# Altium project DIOT_Template.PrjPCB (part 1 of 3)
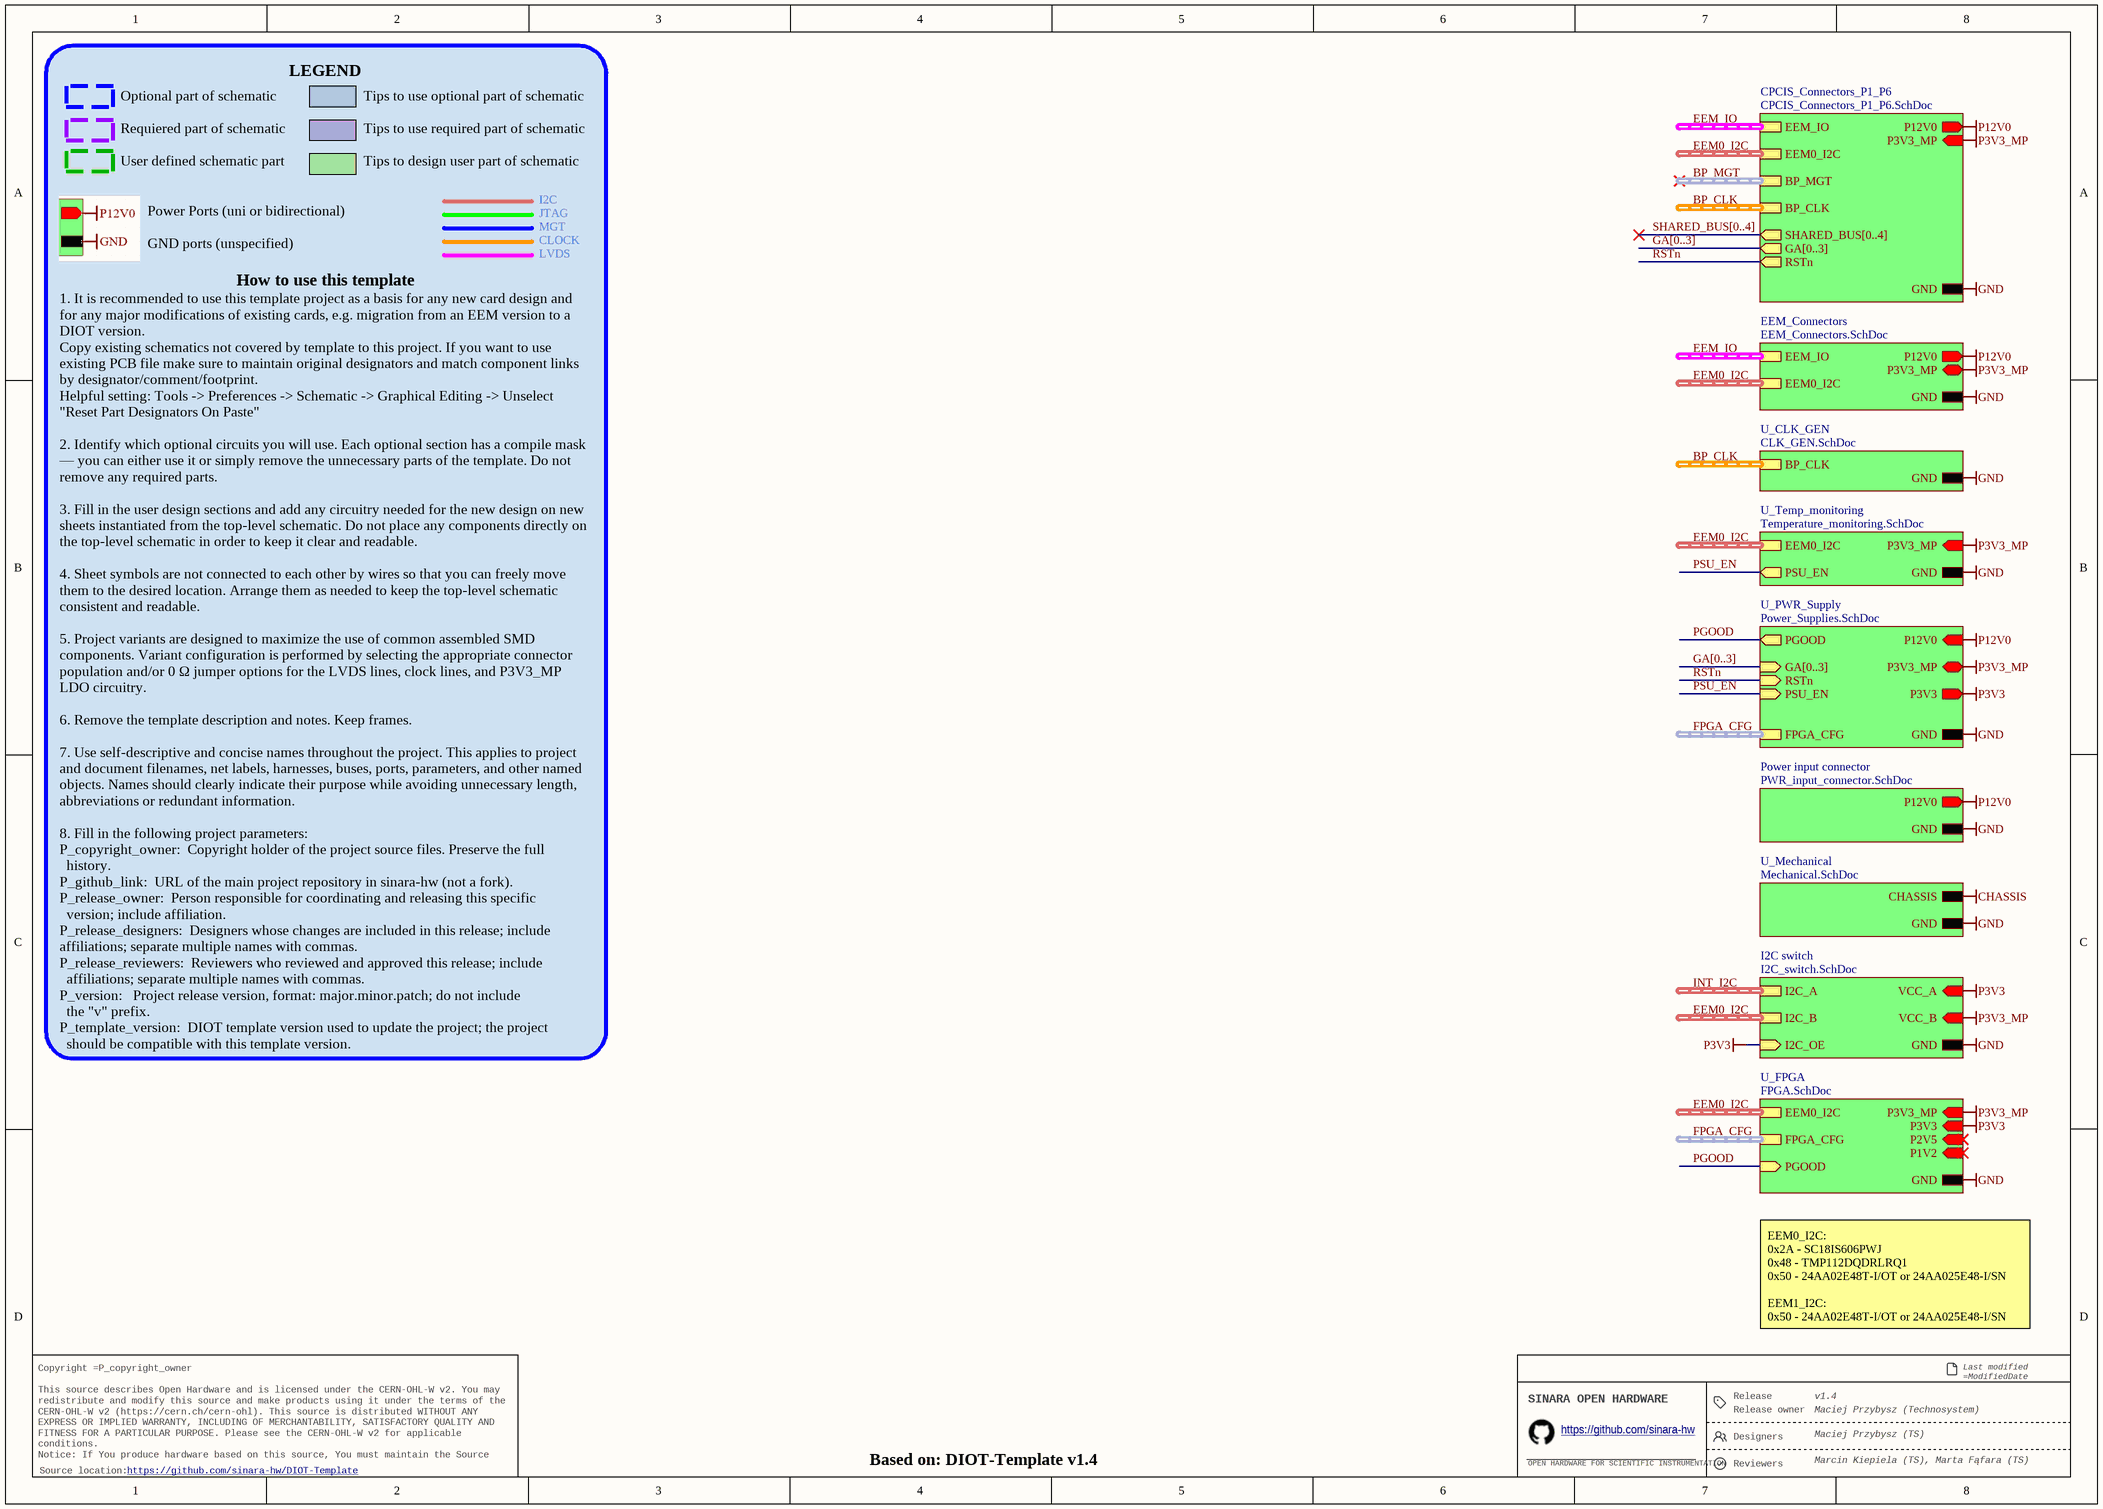
[diagram p0: DIOT_Template.SchDoc]
P_version: 1.4; P_template_version: 1.4; P_release_reviewers: Marcin Kiepiela (TS), Marta Fąfara (TS); P_release_owner: Maciej Przybysz (Technosystem); P_release_designers: Maciej Przybysz (TS); P_github_link: https://github.com/sinara-hw/DIOT-Template; P_copyright_owner: WUT ISE 2024-2025 · Technosystem 2025-2026
18 sheets, 233 parts. Net scope: strictly hierarchical (ports join the sheet entries above them; power ports are local).
Board file: DIOT_Template.PcbDoc
Sheets:
  DIOT_Template.SchDoc
    U_PWR_Supply = Power_Supplies.SchDoc
      U_Power-up_delay = Power-up_delay.SchDoc
      U_Power_main_DCDC = Power_main_DCDC.SchDoc
      LEDs = LEDs.SchDoc
    CPCIS_Connectors_P1_P6 = CPCIS_Connectors_P1_P6.SchDoc
      U_DIOT_signal_routing = DIOT_signal_routing.SchDoc
    EEM_Connectors = EEM_Connectors.SchDoc
    U_CLK_GEN = CLK_GEN.SchDoc
    U_Temp_monitoring = Temperature_monitoring.SchDoc
    Power input connector = PWR_input_connector.SchDoc
    U_Mechanical = Mechanical.SchDoc
    I2C switch = I2C_switch.SchDoc
    U_FPGA = FPGA.SchDoc
      U_FPGA_Bank0-1 = FPGA_Bank0-1.SchDoc
      U_FPGA_Bank2-3 = FPGA_Bank2-3.SchDoc
      U_FPGA_Supply = FPGA_Supply.SchDoc
      U_FPGA_Config = FPGA_Config.SchDoc

## Sheet DIOT_Template.SchDoc: =DocumentName
size A3; DocumentNumber: 1; Revision: 0; SheetNumber: 1; SheetTotal: 18

### Sub-sheets
CPCIS_Connectors_P1_P6 = CPCIS_Connectors_P1_P6.SchDoc: P12V0 (out), P3V3_MP (in), EEM_IO (harness EEM_LVDS), EEM0_I2C (harness I2C), BP_MGT (harness MGT), BP_CLK (harness CLK_DIFF), SHARED_BUS[0..4] (out), GA[0..3] (out), GND, RSTn (out)
EEM_Connectors = EEM_Connectors.SchDoc: P3V3_MP (bidir), P12V0 (out), EEM_IO (harness EEM_LVDS), EEM0_I2C (harness I2C), GND
I2C switch = I2C_switch.SchDoc: I2C_A (harness I2C), I2C_B (harness I2C), I2C_OE (in), GND, VCC_A (in), VCC_B (in)
Power input connector = PWR_input_connector.SchDoc: P12V0 (out), GND
U_CLK_GEN = CLK_GEN.SchDoc: GND, BP_CLK (harness CLK_DIFF)
U_FPGA = FPGA.SchDoc: EEM0_I2C (harness I2C), P1V2 (in), P2V5 (in), P3V3 (in), P3V3_MP (in), GND, PGOOD (in), FPGA_CFG (harness FPGA_CFG)
U_Mechanical = Mechanical.SchDoc: CHASSIS, GND
U_PWR_Supply = Power_Supplies.SchDoc: GND, P12V0 (in), P3V3 (out), P3V3_MP (bidir), PGOOD (out), GA[0..3] (in), RSTn (in), PSU_EN (in), FPGA_CFG (harness FPGA_CFG)
U_Temp_monitoring = Temperature_monitoring.SchDoc: GND, P3V3_MP (in), EEM0_I2C (harness I2C), PSU_EN (out)

### Nets
GND: sheet U_PWR_Supply/GND, sheet CPCIS_Connectors_P1_P6/GND, sheet EEM_Connectors/GND, sheet U_CLK_GEN/GND, sheet U_Temp_monitoring/GND, sheet Power input connector/GND, sheet U_Mechanical/GND, sheet I2C switch/GND, sheet U_FPGA/GND
P3V3: sheet U_PWR_Supply/P3V3, sheet I2C switch/I2C_OE, sheet I2C switch/VCC_A, sheet U_FPGA/P3V3
P3V3_MP: sheet U_PWR_Supply/P3V3_MP, sheet CPCIS_Connectors_P1_P6/P3V3_MP, sheet EEM_Connectors/P3V3_MP, sheet U_Temp_monitoring/P3V3_MP, sheet I2C switch/VCC_B, sheet U_FPGA/P3V3_MP
P12V0: sheet U_PWR_Supply/P12V0, sheet CPCIS_Connectors_P1_P6/P12V0, sheet EEM_Connectors/P12V0, sheet Power input connector/P12V0
PGOOD: sheet U_PWR_Supply/PGOOD, sheet U_FPGA/PGOOD
PSU_EN: sheet U_PWR_Supply/PSU_EN, sheet U_Temp_monitoring/PSU_EN
RSTn: sheet U_PWR_Supply/RSTn, sheet CPCIS_Connectors_P1_P6/RSTn

### Buses and harness runs
bus GA[0..3] = sheet CPCIS_Connectors_P1_P6/GA[0..3]
bus GA[0..3] = sheet U_PWR_Supply/GA[0..3]
bus SHARED_BUS[0..4] = sheet CPCIS_Connectors_P1_P6/SHARED_BUS[0..4]
harness BP_CLK = sheet CPCIS_Connectors_P1_P6/BP_CLK
harness BP_CLK = sheet U_CLK_GEN/BP_CLK
harness BP_MGT = sheet CPCIS_Connectors_P1_P6/BP_MGT
harness EEM0_I2C = sheet CPCIS_Connectors_P1_P6/EEM0_I2C
harness EEM0_I2C = sheet EEM_Connectors/EEM0_I2C
harness EEM0_I2C = sheet I2C switch/I2C_B
harness EEM0_I2C = sheet U_FPGA/EEM0_I2C
harness EEM0_I2C = sheet U_Temp_monitoring/EEM0_I2C
harness EEM_IO = sheet CPCIS_Connectors_P1_P6/EEM_IO
harness EEM_IO = sheet EEM_Connectors/EEM_IO
harness FPGA_CFG = sheet U_FPGA/FPGA_CFG
harness FPGA_CFG = sheet U_PWR_Supply/FPGA_CFG
harness INT_I2C = sheet I2C switch/I2C_A

### Notes on the sheet
- LEGEND
- Optional part of schematic
  Requiered part of schematic
  User defined schematic part
- Tips to use optional part of schematic
  Tips to use required part of schematic
  Tips to design user part of schematic
- I2C
- JTAG
- MGT
- CLOCK
- How to use this template
- Power Ports (uni or bidirectional)
  GND ports (unspecified)
- LVDS
- 1. It is recommended to use this template project as a basis for any new card design and for any major modifications of existing cards, e.g. migration from an EEM version to a DIOT version.
  Copy existing schematics not covered by template to this project. If you want to use existing PCB file make sure to maintain original designators and match component links by designator/comment/footprint.
  Helpful setting: Tools -> Preferences -> Schematic -> Graphical Editing -> Unselect "Reset Part Designators On Paste"
  2. Identify which optional circuits you will use. Each optional section has a compile mask — you can either use it or simply remove the unnecessary parts of the template. Do not remove any required parts.
  3. Fill in the user design sections and add any circuitry needed for the new design on new sheets instantiated from the top-level schematic. Do not place any components directly on the top-level schematic in order to keep it clear and readable.
  4. Sheet symbols are not connected to each other by wires so that you can freely move them to the desired location. Arrange them as needed to keep the top-level schematic consistent and readable.
  5. Project variants are designed to maximize the use of common assembled SMD components. Variant configuration is performed by selecting the appropriate connector population and/or 0 Ω jumper options for the LVDS lines, clock lines, and P3V3_MP LDO circuitry.
  6. Remove the template description and notes. Keep frames.
  7. Use self-descriptive and concise names throughout the project. This applies to project and document filenames, net labels, harnesses, buses, ports, parameters, and other named objects. Names should clearly indicate their purpose while avoiding unnecessary length, abbreviations or redundant information.
  8. Fill in the following project parameters:
  P_copyright_owner: 	Copyright holder of the project source files. Preserve the full
  history.
  P_github_link: 	URL of the main project repository in sinara-hw (not a fork).
  P_release_owner: 	Person responsible for coordinating and releasing this specific
  version; include affiliation.
  P_release_designers: 	Designers whose changes are included in this release; include 				affiliations; separate multiple names with commas.
  P_release_reviewers: 	Reviewers who reviewed and approved this release; include
  affiliations; separate multiple names with commas.
  P_version: 		Project release version, format: major.minor.patch; do not include
  the "v" prefix.
  P_template_version: 	DIOT template version used to update the project; the project
  should be compatible with this template version.
- EEM0_I2C:
  0x2A - SC18IS606PWJ
  0x48 - TMP112DQDRLRQ1
  0x50 - 24AA02E48T-I/OT or 24AA025E48-I/SN
  EEM1_I2C:
  0x50 - 24AA02E48T-I/OT or 24AA025E48-I/SN
- Release
- Last modified =ModifiedDate
  Sheet =sheetnumber of =sheettotal · Size A3
- Copyright =P_copyright_owner
  This source describes Open Hardware and is licensed under the CERN-OHL-W v2. You may redistribute and modify this source and make products using it under the terms of the CERN-OHL-W v2 (https://cern.ch/cern-ohl). This source is distributed WITHOUT ANY EXPRESS OR IMPLIED WARRANTY, INCLUDING OF MERCHANTABILITY, SATISFACTORY QUALITY AND FITNESS FOR A PARTICULAR PURPOSE. Please see the CERN-OHL-W v2 for applicable conditions.
  Notice: If You produce hardware based on this source, You must maintain the Source Location visible on the product, its packaging or its documentation.
- SINARA OPEN HARDWARE
- OPEN HARDWARE FOR SCIENTIFIC INSTRUMENTATION
- https://github.com/sinara-hw
- Release owner
- Designers
- Reviewers
- Source location:

## Sheet Power_Supplies.SchDoc: =DocumentName
size A4; DocumentNumber: 1; Revision: 0; SheetNumber: 2; SheetTotal: 18
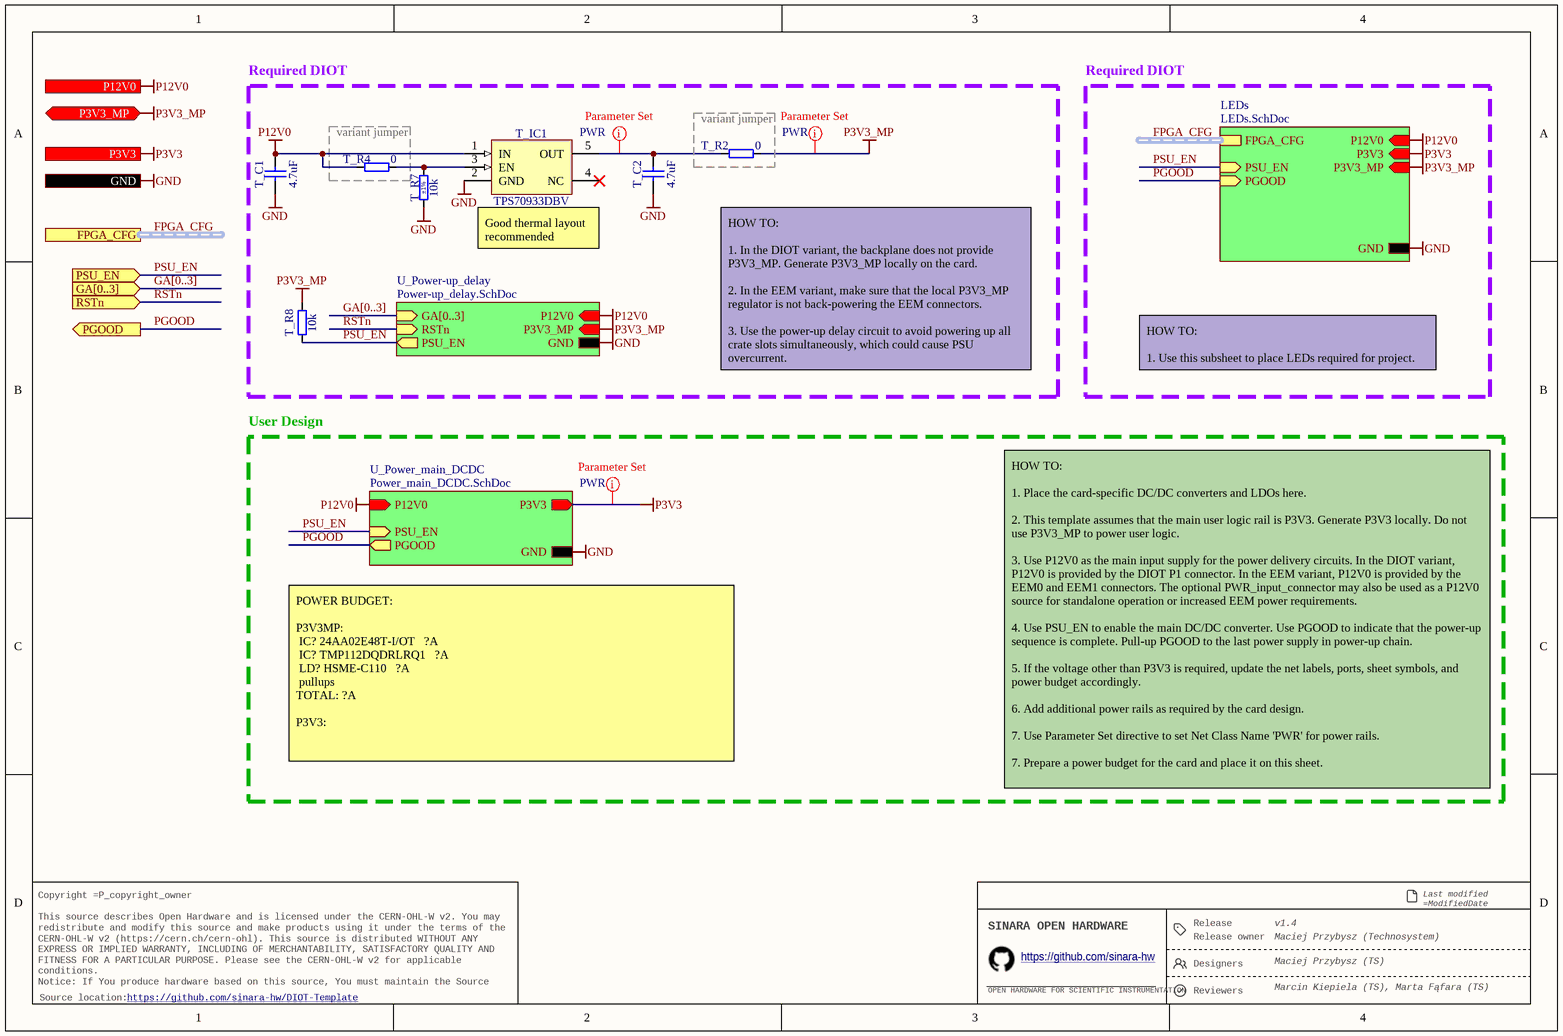
[diagram p1: Power_Supplies.SchDoc]

### Parts
T_C1  4.7uF  [CAPC2012X135N]
T_C2  4.7uF  [CAPC2012X135N]
T_IC1  TPS70933DBV  [SOT95P280X145-5N]
T_R2  0  [RESC1005X40N]
T_R4  0  [RESC1005X40N]
T_R7  10k  Tolerance: ±1%  [RESC1005X40N]
T_R8  10k  [RESC1005X40N]

### Blocks framed on the sheet
Required DIOT: T_C1 T_C2 T_IC1 T_R7 T_R8
variant jumper: T_R4
variant jumper: T_R2

### Sub-sheets
LEDs = LEDs.SchDoc: PSU_EN (in), PGOOD (in), P3V3_MP (in), P12V0 (in), P3V3 (in), FPGA_CFG (harness FPGA_CFG), GND
U_Power-up_delay = Power-up_delay.SchDoc: GA[0..3] (in), RSTn (in), GND, PSU_EN (out), P3V3_MP (in), P12V0 (in)
U_Power_main_DCDC = Power_main_DCDC.SchDoc: P12V0 (in), P3V3 (out), GND, PSU_EN (in), PGOOD (out)

### Ports
FPGA_CFG (harness FPGA_CFG), GA[0..3] (in), GND, P3V3 (out), P3V3_MP (bidir), P12V0 (in), PGOOD (out), PSU_EN (in), RSTn (in)

### Nets
GND: T_C1.1 T_C2.1 T_IC1.2(GND) T_R7.1 ; port GND, sheet U_Power-up_delay/GND, sheet U_Power_main_DCDC/GND, sheet LEDs/GND
P3V3: port P3V3, sheet U_Power_main_DCDC/P3V3, sheet LEDs/P3V3
P3V3_MP: T_R2.2 T_R8.2 ; port P3V3_MP, sheet U_Power-up_delay/P3V3_MP, sheet LEDs/P3V3_MP
P12V0: T_C1.2 T_IC1.1(IN) T_R4.1 ; port P12V0, sheet U_Power-up_delay/P12V0, sheet U_Power_main_DCDC/P12V0, sheet LEDs/P12V0
PGOOD: port PGOOD, sheet U_Power_main_DCDC/PGOOD, sheet LEDs/PGOOD
PSU_EN: T_R8.1 ; port PSU_EN, sheet U_Power-up_delay/PSU_EN, sheet U_Power_main_DCDC/PSU_EN, sheet LEDs/PSU_EN
RSTn: port RSTn, sheet U_Power-up_delay/RSTn
NetT_C2_2: T_C2.2 T_IC1.5(OUT) T_R2.1
NetT_IC1_3: T_IC1.3(EN) T_R4.2 T_R7.2

Not connected (* = marked no-connect by the designer): T_IC1 4(NC)*

### Buses and harness runs
bus GA[0..3] = port GA[0..3]
bus GA[0..3] = sheet U_Power-up_delay/GA[0..3]
harness FPGA_CFG = port FPGA_CFG
harness FPGA_CFG = sheet LEDs/FPGA_CFG

### Layout directives
net class PWR: NetT_C2_2, P3V3, P3V3_MP

### Notes on the sheet
- Required DIOT
- (near T_IC1) Good thermal layout recommended
- HOW TO:
  1. In the DIOT variant, the backplane does not provide P3V3_MP. Generate P3V3_MP locally on the card.
  2. In the EEM variant, make sure that the local P3V3_MP regulator is not back-powering the EEM connectors.
  3. Use the power-up delay circuit to avoid powering up all crate slots simultaneously, which could cause PSU overcurrent.
- HOW TO:
  1. Use this subsheet to place LEDs required for project.
- User Design
- POWER BUDGET:
  P3V3MP:
  IC?	24AA02E48T-I/OT			?A
  IC?	TMP112DQDRLRQ1			?A
  LD?	HSME-C110			?A
  pullups
  TOTAL: ?A
  P3V3:
- HOW TO:
  1. Place the card-specific DC/DC converters and LDOs here.
  2. This template assumes that the main user logic rail is P3V3. Generate P3V3 locally. Do not use P3V3_MP to power user logic.
  3. Use P12V0 as the main input supply for the power delivery circuits. In the DIOT variant, P12V0 is provided by the DIOT P1 connector. In the EEM variant, P12V0 is provided by the EEM0 and EEM1 connectors. The optional PWR_input_connector may also be used as a P12V0 source for standalone operation or increased EEM power requirements.
  4. Use PSU_EN to enable the main DC/DC converter. Use PGOOD to indicate that the power-up sequence is complete. Pull-up PGOOD to the last power supply in power-up chain.
  5. If the voltage other than P3V3 is required, update the net labels, ports, sheet symbols, and power budget accordingly.
  6. Add additional power rails as required by the card design.
  7. Use Parameter Set directive to set Net Class Name 'PWR' for power rails.
  7. Prepare a power budget for the card and place it on this sheet.
- Release
- Last modified =ModifiedDate
  Sheet =sheetnumber of =sheettotal · Size A4
- Copyright =P_copyright_owner
  This source describes Open Hardware and is licensed under the CERN-OHL-W v2. You may redistribute and modify this source and make products using it under the terms of the CERN-OHL-W v2 (https://cern.ch/cern-ohl). This source is distributed WITHOUT ANY EXPRESS OR IMPLIED WARRANTY, INCLUDING OF MERCHANTABILITY, SATISFACTORY QUALITY AND FITNESS FOR A PARTICULAR PURPOSE. Please see the CERN-OHL-W v2 for applicable conditions.
  Notice: If You produce hardware based on this source, You must maintain the Source Location visible on the product, its packaging or its documentation.
- SINARA OPEN HARDWARE
- OPEN HARDWARE FOR SCIENTIFIC INSTRUMENTATION
- https://github.com/sinara-hw
- Release owner
- Designers
- Reviewers
- Source location:
- (in symbol R0402_10K_1%_0.0625W_100PPM) 1%

### Library data of the parts
T_C1 T_C2 = CC0805_4.7UF_16V_10%_X7R: Non-polarised capacitor; Part Description: SMD Multilayer Chip Ceramic Capacitor; Manufacturer: GENERIC; Manufacturer1 Part Number: EMK212B7475KG-T; Voltage: 16V; TC: X7R; Tolerance: ±10%; Part Number: CC0805_4.7UF_16V_10%_X7R; Component Kind: Standard; Component Type: Standard; Pin Count: 2; Value: 4.7uF; Status: Preferred; Manufacturer Part Number: CC0805_4.7UF_16V_10%_X7R; Case: 0805; Mounted: Yes; Socket: No; SMD: Yes; Sense: No; Manufacturer1 Example: TAIYO YUDEN; Manufacturer1 ComponentHeight: 1.35mm; HelpURL: \\cern.ch\dfs\Applications\Altium\Datasheets\CC0805_X7R_TAIYO-YUDEN_HIGH-VALUE.pdf; Author: CERN DEM JLC; CreateDate: 16.09.2014; LatestRevisionDate: 16.09.2014
T_IC1 = TPS70933DBV: 150-mA, 30-V, 1-µA IQ Voltage Regulators with Enable; Part Description: 3.3V, 150-mA, 30-V, 1-µA IQ Voltage Regulators with Enable; Manufacturer: TEXAS INSTRUMENTS; PressFit: No; Bonding: No; Part Number: TPS70933DBV; Component Kind: Standard; Component Type: Standard; Device: TPS70933DBV; PackageDescription: SOT23, 0.95mm Pitch; 5 Pin, 1.60mm W X 2.90mm L X 1.45mm H body, IPC Medium Density; Manufacturer Part Number: TPS70933DBV; Pin Count: 5; Case: SOT23-5; Mounted: Yes; Socket: No; SMD: Yes; Sense: No; ComponentHeight: 1.45mm; HelpURL: \\cern.ch\dfs\Applications\Altium\Datasheets\TPS709.pdf; Author: CERN DEM JLC; CreateDate: 17.03.2011; LatestRevisionDate: 17.03.2011
T_R2 T_R4 = R0402_0R_JUMPER: Resistor; Part Description: 1A (0.05R Max DC Resistance) Zero Ohm Jumper; Manufacturer: GENERIC; Manufacturer1 Part Number: 232270591001L; PressFit: No; Part Number: R0402_0R_JUMPER; Component Kind: Standard; Component Type: Standard; Pin Count: 2; Value: 0; Status: Not Recommended; Manufacturer Part Number: R0402_0R_JUMPER; Case: 0402; Mounted: Yes; Sense: No; Socket: No; SMD: Yes; Manufacturer1 Example: YAGEO PHYCOMP; Manufacturer1 ComponentHeight: 0.4mm; HelpURL: \\cern.ch\dfs\Applications\Altium\Datasheets\R0402_Phycomp_RC0402.pdf; Author: CERN DEM JLC; CreateDate: 03.12.2007; LatestRevisionDate: 17.10.2012
T_R7 T_R8 = R0402_10K_1%_0.0625W_100PPM: Resistor - 1%; Part Description: General Purpose Thick Film Chip Resistor; Manufacturer: GENERIC; Manufacturer1 Part Number: 232270671003L; TC: ±100ppm/°C; PressFit: No; Part Number: R0402_10K_1%_0.0625W_100PPM; Component Kind: Standard; Component Type: Standard; Pin Count: 2; Value: 10k; Status: Not Recommended; Power: 0.0625W; Manufacturer Part Number: R0402_10K_1%_0.0625W_100PPM; Case: 0402; Mounted: Yes; Sense: No; Socket: No; SMD: Yes; Manufacturer1 Example: YAGEO PHYCOMP; Manufacturer1 ComponentHeight: 0.4mm; HelpURL: \\cern.ch\dfs\Applications\Altium\Datasheets\R0402_Phycomp_RC0402.pdf; Author: CERN DEM JLC; CreateDate: 03.12.2007; LatestRevisionDate: 17.10.2012
  T_R8: Tolerance: ±1%

## Sheet Power-up_delay.SchDoc: =DocumentName
size A4; DocumentNumber: 1; Revision: 0; SheetNumber: 3; SheetTotal: 18
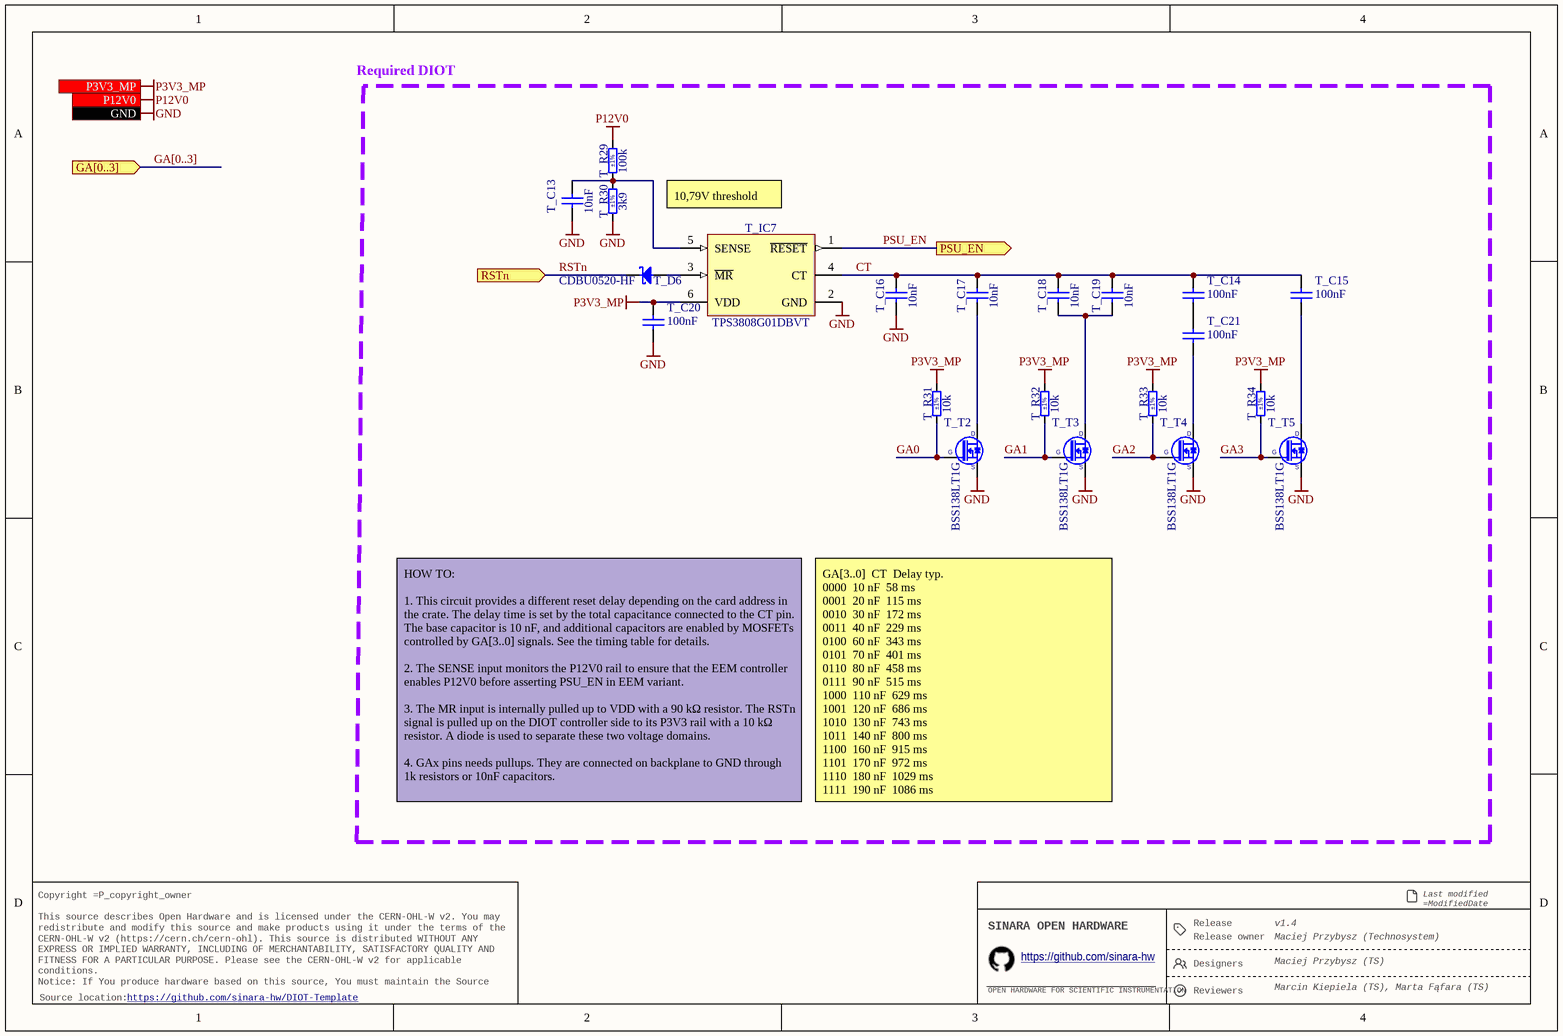
[diagram p2: Power-up_delay.SchDoc]

### Parts
T_C13  10nF  [CAPC1005X55N]
T_C14  100nF  [CAPC1005X55N]
T_C15  100nF  [CAPC1005X55N]
T_C16  10nF  [CAPC1005X55N]
T_C17  10nF  [CAPC1005X55N]
T_C18  10nF  [CAPC1005X55N]
T_C19  10nF  [CAPC1005X55N]
T_C20  100nF  [CAPC1005X55N]
T_C21  100nF  [CAPC1005X55N]
T_D6  CDBU0520-HF  [SOD-523F]
T_IC7  TPS3808G01DBVT  [SOT95P280X145-6N]
T_R29  100k  Tolerance: ±1%  [RESC1005X40N]
T_R30  3k9  Tolerance: ±1%  [RESC1005X40N]
T_R31  10k  Tolerance: ±1%  [RESC1005X40N]
T_R32  10k  Tolerance: ±1%  [RESC1005X40N]
T_R33  10k  Tolerance: ±1%  [RESC1005X40N]
T_R34  10k  Tolerance: ±1%  [RESC1005X40N]
T_T2  BSS138LT1G  [SOT95P240X110-3N]
T_T3  BSS138LT1G  [SOT95P240X110-3N]
T_T4  BSS138LT1G  [SOT95P240X110-3N]
T_T5  BSS138LT1G  [SOT95P240X110-3N]

### Blocks framed on the sheet
Required DIOT: T_C13-T_C21 T_D6 T_IC7 T_R29-T_R34 T_T2-T_T5

### Ports
GA[0..3] (in), GND, P3V3_MP (in), P12V0 (in), PSU_EN (out), RSTn (in)

### Nets
GND: T_C13.2 T_C16.1 T_C20.1 T_IC7.2(GND) T_R30.1 T_T2.2(S) T_T3.2(S) T_T4.2(S) T_T5.2(S) ; port GND
P3V3_MP: T_C20.2 T_IC7.6(VDD) T_R31.2 T_R32.2 T_R33.2 T_R34.2 ; port P3V3_MP
P12V0: T_R29.1 ; port P12V0
CT: T_C14.2 T_C15.2 T_C16.2 T_C17.2 T_C18.2 T_C19.2 T_IC7.4(CT)
GA0: T_R31.1 T_T2.1(G)
GA1: T_R32.1 T_T3.1(G)
GA2: T_R33.1 T_T4.1(G)
GA3: T_R34.1 T_T5.1(G)
PSU_EN: T_IC7.1(~{RESET}) ; port PSU_EN
RSTn: T_D6.1(C) ; port RSTn
NetT_C13_1: T_C13.1 T_IC7.5(SENSE) T_R29.2 T_R30.2
NetT_C14_1: T_C14.1 T_C21.2
NetT_C15_1: T_C15.1 T_T5.3(D)
NetT_C17_1: T_C17.1 T_T2.3(D)
NetT_C18_1: T_C18.1 T_C19.1 T_T3.3(D)
NetT_C21_1: T_C21.1 T_T4.3(D)
NetT_D6_2: T_D6.2(A) T_IC7.3(~{MR})

### Buses and harness runs
bus GA[0..3] = port GA[0..3]

### Notes on the sheet
- 10,79V threshold
- HOW TO:
  1. This circuit provides a different reset delay depending on the card address in the crate. The delay time is set by the total capacitance connected to the CT pin. The base capacitor is 10 nF, and additional capacitors are enabled by MOSFETs controlled by GA[3..0] signals. See the timing table for details.
  2. The SENSE input monitors the P12V0 rail to ensure that the EEM controller enables P12V0 before asserting PSU_EN in EEM variant.
  3. The MR input is internally pulled up to VDD with a 90 kΩ resistor. The RSTn signal is pulled up on the DIOT controller side to its P3V3 rail with a 10 kΩ resistor. A diode is used to separate these two voltage domains.
  4. GAx pins needs pullups. They are connected on backplane to GND through 1k resistors or 10nF capacitors.
- GA[3..0]		CT		Delay typ.
  0000		10 nF		58 ms
  0001		20 nF		115 ms
  0010		30 nF		172 ms
  0011		40 nF		229 ms
  0100		60 nF		343 ms
  0101		70 nF		401 ms
  0110		80 nF		458 ms
  0111		90 nF		515 ms
  1000		110 nF		629 ms
  1001		120 nF		686 ms
  1010		130 nF		743 ms
  1011		140 nF		800 ms
  1100		160 nF		915 ms
  1101		170 nF		972 ms
  1110		180 nF		1029 ms
  1111		190 nF		1086 ms
- Release
- Last modified =ModifiedDate
  Sheet =sheetnumber of =sheettotal · Size A4
- Copyright =P_copyright_owner
  This source describes Open Hardware and is licensed under the CERN-OHL-W v2. You may redistribute and modify this source and make products using it under the terms of the CERN-OHL-W v2 (https://cern.ch/cern-ohl). This source is distributed WITHOUT ANY EXPRESS OR IMPLIED WARRANTY, INCLUDING OF MERCHANTABILITY, SATISFACTORY QUALITY AND FITNESS FOR A PARTICULAR PURPOSE. Please see the CERN-OHL-W v2 for applicable conditions.
  Notice: If You produce hardware based on this source, You must maintain the Source Location visible on the product, its packaging or its documentation.
- SINARA OPEN HARDWARE
- OPEN HARDWARE FOR SCIENTIFIC INSTRUMENTATION
- https://github.com/sinara-hw
- Release owner
- Designers
- Reviewers
- Source location:

### Library data of the parts
T_C13 T_C16-T_C19 = CC0402_10NF_50V_5%_X7R: Non-polarised capacitor; Part Description: SMD Multilayer Chip Ceramic Capacitor; Manufacturer: GENERIC; Manufacturer1 Part Number: C0402C103J5RAC; Voltage: 50V; TC: X7R; Tolerance: ±5%; Part Number: CC0402_10NF_50V_5%_X7R; Component Kind: Standard; Component Type: Standard; Pin Count: 2; Value: 10nF; Status: Preferred; Manufacturer Part Number: CC0402_10NF_50V_5%_X7R; Case: 0402; Mounted: Yes; Socket: No; SMD: Yes; Sense: No; Manufacturer1 Example: KEMET; Manufacturer1 ComponentHeight: 0.55mm; HelpURL: \\cern.ch\dfs\Applications\Altium\Datasheets\CC0402_X7R_KEMET.pdf; Author: CERN DEM BC; CreateDate: 15.07.2020; LatestRevisionDate: 15.07.2020
T_C14 T_C15 T_C20 T_C21 = CC0402_100NF_50V_10%_X7R: Non-polarised capacitor; Part Description: SMD Multilayer Chip Ceramic Capacitor; Manufacturer: GENERIC; Manufacturer1 Part Number: GRM155R71H104KE14D; Voltage: 50V; TC: X7R; Tolerance: ±10%; Part Number: CC0402_100NF_50V_10%_X7R; Component Kind: Standard; Component Type: Standard; Pin Count: 2; Value: 100nF; Status: None; Manufacturer Part Number: CC0402_100NF_50V_10%_X7R; Case: 0402; Mounted: Yes; Socket: No; SMD: Yes; Sense: No; Manufacturer1 Example: MURATA; Manufacturer1 ComponentHeight: 0.55mm; HelpURL: \\cern.ch\dfs\Applications\Altium\Datasheets\CC0402_MURATA_GRM155R71H104KE14D.pdf; Author: CERN DEM MR; CreateDate: 30.06.2017; LatestRevisionDate: 30.06.2017
T_D6 = CDBU0520-HF: Schottky Diode; Part Description: 20V Surface mount Schottky Barrier Diode; Manufacturer: COMCHIP; Voltage: 20V; Power: 500mA; PressFit: No; Bonding: No; Part Number: CDBU0520-HF; Component Kind: Standard; Component Type: Standard; Device: CDBU0520-HF; PackageDescription: Small Outline Diode Flat Lead (SOD-523F), Body; 1.80mm L X 1mm W X 0.85mm H; Manufacturer Part Number: CDBU0520-HF; Pin Count: 2; Case: SOD-523F; Mounted: Yes; Socket: No; SMD: Yes; Sense: No; ComponentHeight: 1mm; HelpURL: \\cern.ch\dfs\Applications\Altium\Datasheets\CDBU0520-HF.pdf; Author: CERN DEM HF; CreateDate: 13.10.2023; LatestRevisionDate: 13.10.2023
T_IC7 = TPS3808G01DBVT: Low Quiescent Current, Programmable-Delay Supervisory Circuit; Part Description: Adjustable Low Quiescent Current, Programmable-Delay Supervisory Circuit; Manufacturer: TEXAS INSTRUMENTS; PressFit: No; Bonding: No; Part Number: TPS3808G01DBVT; Component Kind: Standard; Component Type: Standard; Device: TPS3808G01DBVT; PackageDescription: SOT, 0.95mm Pitch; 6 Pin, 1.60mm W X 2.90mm L X 1.45mm H body, IPC Medium Density; Manufacturer Part Number: TPS3808G01DBV; Pin Count: 6; Case: SOT23-6; Mounted: Yes; Socket: No; SMD: Yes; Sense: No; ComponentHeight: 1.45mm; Author: CERN DEM JLC; HelpURL: \\cern.ch\dfs\Applications\Altium\Datasheets\TPS3808G01DBVT.pdf; CreateDate: 22.10.2008; LatestRevisionDate: 10.06.2022
T_R29 = R0402_100K_1%_0.0625W_100PPM: Resistor - 1%; Part Description: General Purpose Thick Film Chip Resistor; Manufacturer: GENERIC; Manufacturer1 Part Number: 232270671004L; TC: ±100ppm/°C; PressFit: No; Part Number: R0402_100K_1%_0.0625W_100PPM; Component Kind: Standard; Component Type: Standard; Pin Count: 2; Value: 100k; Status: Not Recommended; Power: 0.0625W; Manufacturer Part Number: R0402_100K_1%_0.0625W_100PPM; Case: 0402; Mounted: Yes; Sense: No; Socket: No; SMD: Yes; Manufacturer1 Example: YAGEO PHYCOMP; Manufacturer1 ComponentHeight: 0.4mm; HelpURL: \\cern.ch\dfs\Applications\Altium\Datasheets\R0402_Phycomp_RC0402.pdf; Author: CERN DEM JLC; CreateDate: 03.12.2007; LatestRevisionDate: 17.10.2012
T_R30 = R0402_3K9_1%_0.0625W_100PPM: Resistor - 1%; Part Description: General Purpose Thick Film Chip Resistor; Manufacturer: GENERIC; Manufacturer1 Part Number: 232270673902L; TC: ±100ppm/°C; PressFit: No; Part Number: R0402_3K9_1%_0.0625W_100PPM; Component Kind: Standard; Component Type: Standard; Pin Count: 2; Value: 3k9; Status: Not Recommended; Power: 0.0625W; Manufacturer Part Number: R0402_3K9_1%_0.0625W_100PPM; Case: 0402; Mounted: Yes; Sense: No; Socket: No; SMD: Yes; Manufacturer1 Example: YAGEO PHYCOMP; Manufacturer1 ComponentHeight: 0.4mm; HelpURL: \\cern.ch\dfs\Applications\Altium\Datasheets\R0402_Phycomp_RC0402.pdf; Author: CERN DEM JLC; CreateDate: 03.12.2007; LatestRevisionDate: 17.10.2012
T_R31-T_R34 = R0402_10K_1%_0.0625W_100PPM: as T_R7 on sheet Power_Supplies; Part Number: R0402_10K_1%_0.0625W_100PPM; Component Kind: Standard; Component Type: Standard; Pin Count: 2; Value: 10k; Status: Not Recommended; Power: 0.0625W; Manufacturer Part Number: R0402_10K_1%_0.0625W_100PPM; Case: 0402; Mounted: Yes; Sense: No; Socket: No; SMD: Yes; Manufacturer1 Example: YAGEO PHYCOMP; Manufacturer1 ComponentHeight: 0.4mm; HelpURL: \\cern.ch\dfs\Applications\Altium\Datasheets\R0402_Phycomp_RC0402.pdf; Author: CERN DEM JLC; CreateDate: 03.12.2007; LatestRevisionDate: 17.10.2012
T_T2-T_T5 = BSS138LT1G: N-CHANNEL MOSFET WITH DIODE; Part Description: 50V, 200mA N-Channel Enhancement Mode Field-Effect Transistor; Manufacturer: ON SEMICONDUCTOR; PressFit: No; Bonding: No; Part Number: BSS138LT1G; Component Kind: Standard; Component Type: Standard; Device: BSS138LT1G; PackageDescription: SOT23, 0.95mm Pitch; 3 Pin, 1.40mm W X 3.00mm L X 1.10mm H body, IPC Medium Density; Manufacturer Part Number: BSS138L; Pin Count: 3; Case: SOT23-3; Mounted: Yes; Socket: No; SMD: Yes; Sense: No; ComponentHeight: 1.11mm; HelpURL: \\cern.ch\dfs\Applications\Altium\Datasheets\BSS138LT1G.pdf; Author: CERN DEM JLC; CreateDate: 23.03.2009; LatestRevisionDate: 25.05.2022

## Sheet Power_main_DCDC.SchDoc: =DocumentName
size A4; DocumentNumber: 1; Revision: 0; SheetNumber: 4; SheetTotal: 18
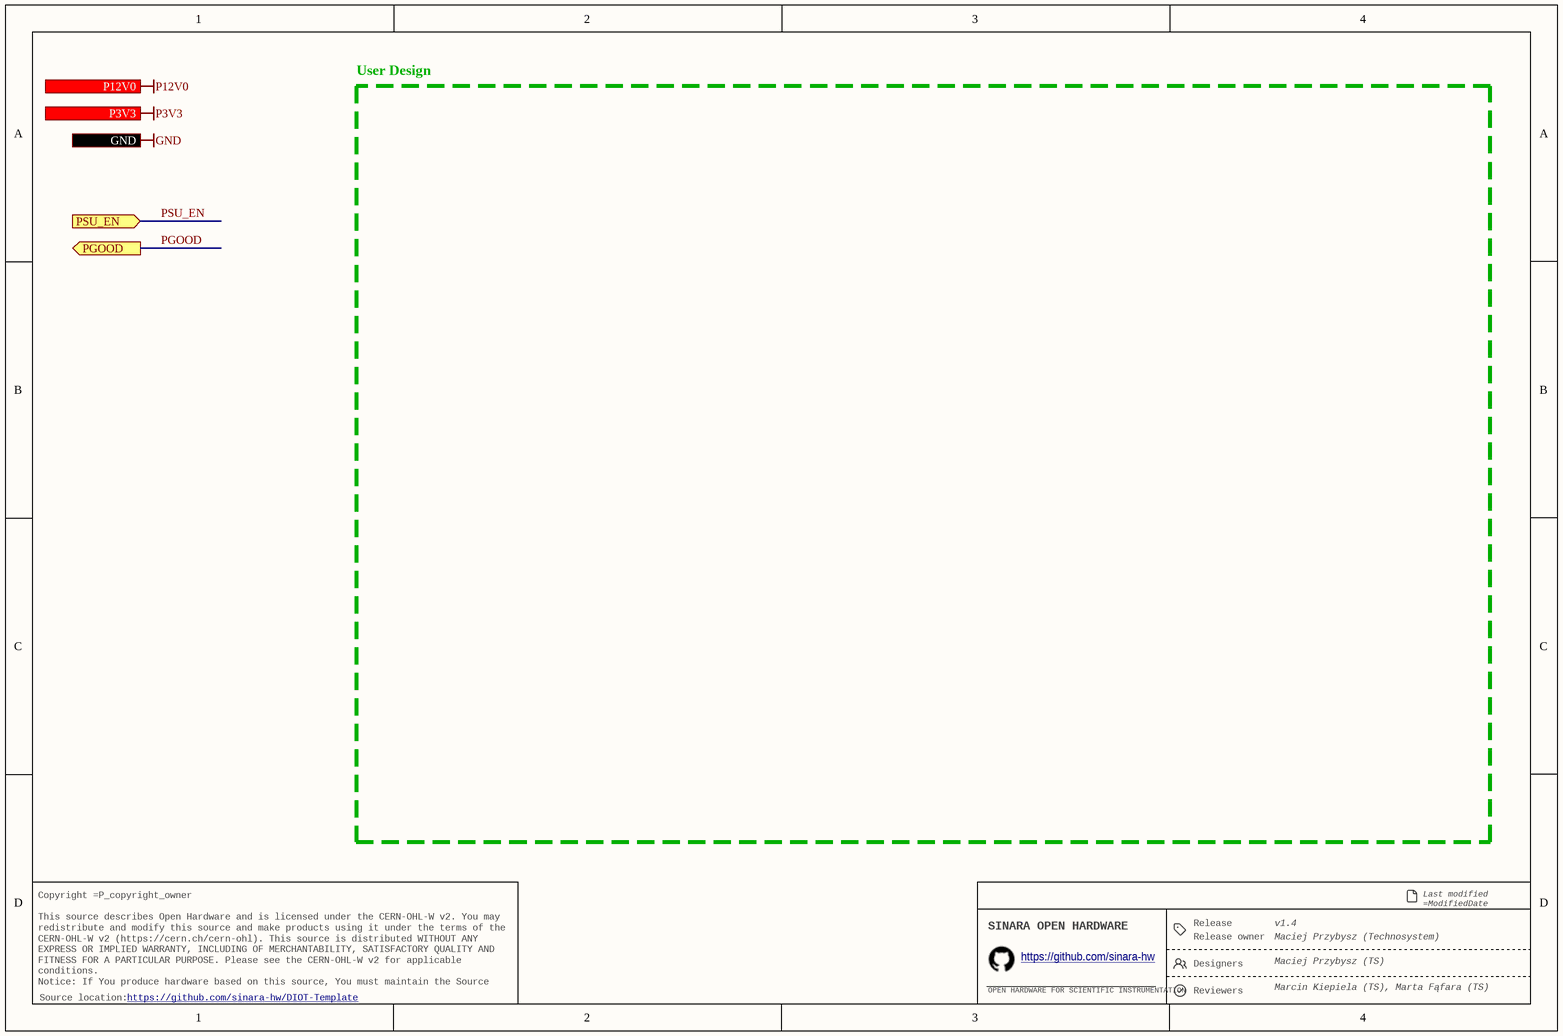
[diagram p3: Power_main_DCDC.SchDoc]

### Ports
GND, P3V3 (out), P12V0 (in), PGOOD (out), PSU_EN (in)

### Notes on the sheet
- User Design
- Release
- Last modified =ModifiedDate
  Sheet =sheetnumber of =sheettotal · Size A4
- Copyright =P_copyright_owner
  This source describes Open Hardware and is licensed under the CERN-OHL-W v2. You may redistribute and modify this source and make products using it under the terms of the CERN-OHL-W v2 (https://cern.ch/cern-ohl). This source is distributed WITHOUT ANY EXPRESS OR IMPLIED WARRANTY, INCLUDING OF MERCHANTABILITY, SATISFACTORY QUALITY AND FITNESS FOR A PARTICULAR PURPOSE. Please see the CERN-OHL-W v2 for applicable conditions.
  Notice: If You produce hardware based on this source, You must maintain the Source Location visible on the product, its packaging or its documentation.
- SINARA OPEN HARDWARE
- OPEN HARDWARE FOR SCIENTIFIC INSTRUMENTATION
- https://github.com/sinara-hw
- Release owner
- Designers
- Reviewers
- Source location:

## Sheet LEDs.SchDoc: =DocumentName
size A4; DocumentNumber: 1; Revision: 0; SheetNumber: 5; SheetTotal: 18
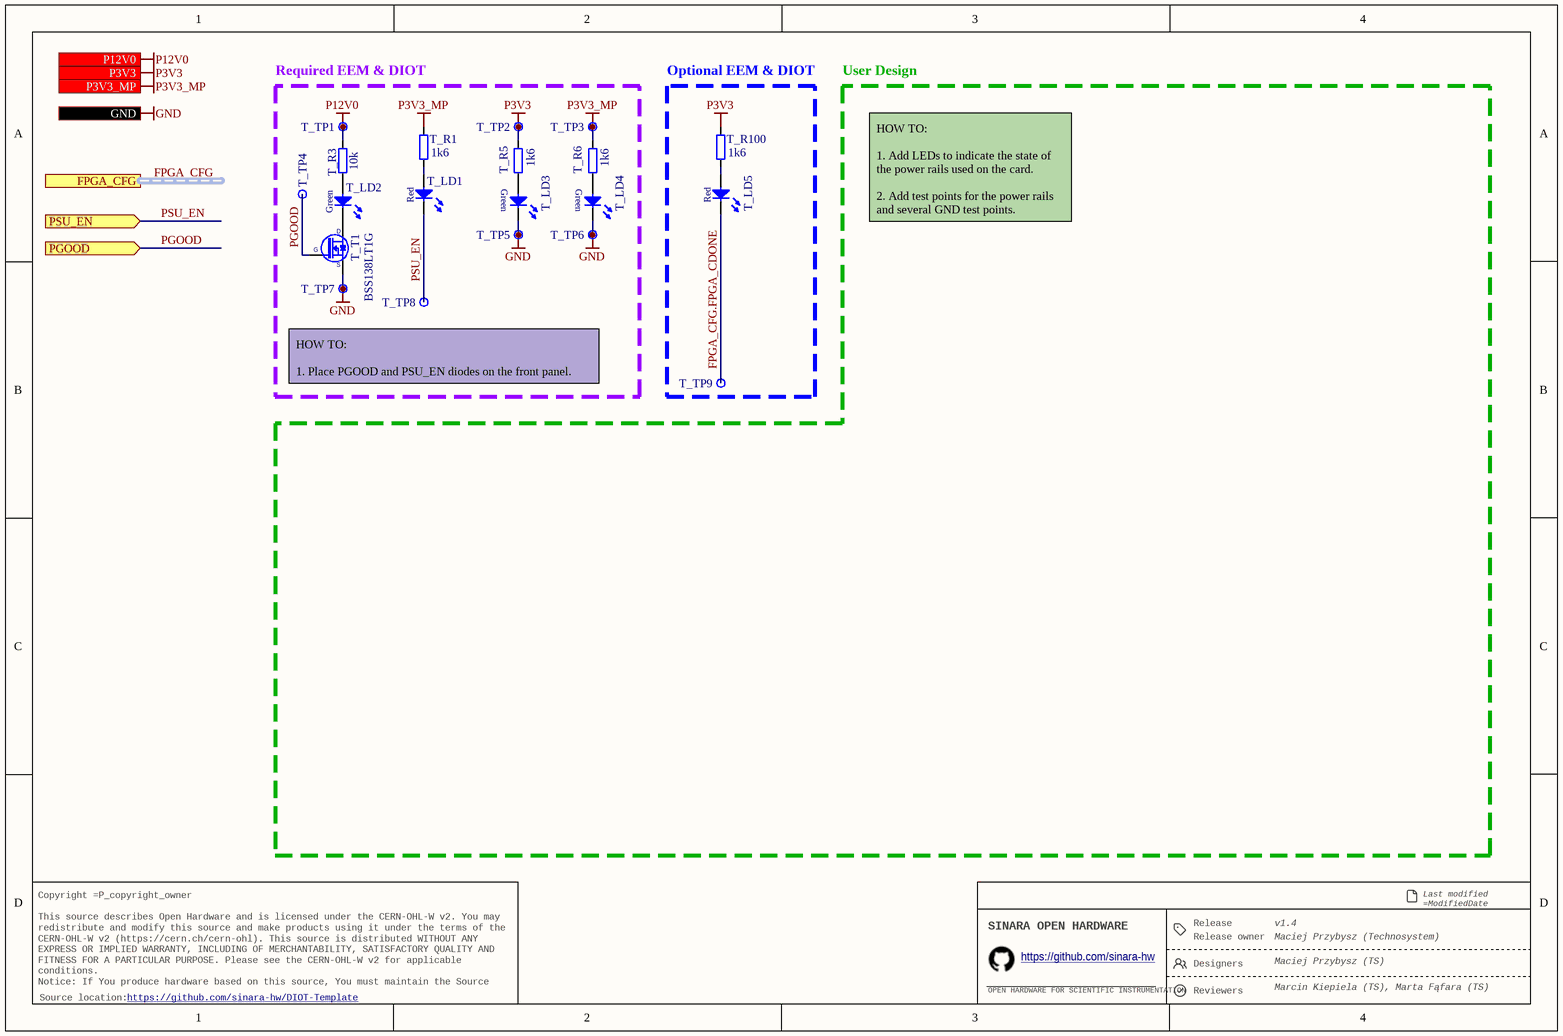
[diagram p4: LEDs.SchDoc]

### Parts
T_LD1  Red  [LED_AVAGO_HSMC-C110]
T_LD2  Green  [LED_AVAGO_HSME-C110]
T_LD3  Green  [LED_KINGBRIGHT_KPH-1608CGCK]  (value not drawn)
T_LD4  Green  [LED_KINGBRIGHT_KPH-1608CGCK]  (value not drawn)
T_LD5  Red  [LED_AVAGO_HSMC-C110]
T_R1  1k6  [RESC1005X40N]
T_R3  10k  [RESC1005X40N]
T_R5  1k6  [RESC1005X40N]
T_R6  1k6  [RESC1005X40N]
T_R100  1k6  [RESC1005X40N]
T_T1  BSS138LT1G  [SOT95P240X110-3N]
T_TP1  Test Point  [TPS127]  (value not drawn)  (no BOM)
T_TP2  Test Point  [TPS127]  (value not drawn)  (no BOM)
T_TP3  Test Point  [TPS127]  (value not drawn)  (no BOM)
T_TP4  Test Point  [TPS127]  (value not drawn)  (no BOM)
T_TP5  Test Point  [TPS127]  (value not drawn)  (no BOM)
T_TP6  Test Point  [TPS127]  (value not drawn)  (no BOM)
T_TP7  Test Point  [TPS127]  (value not drawn)  (no BOM)
T_TP8  Test Point  [TPS127]  (value not drawn)  (no BOM)
T_TP9  Test Point  [TPS127]  (value not drawn)  (no BOM)

### Blocks framed on the sheet
Required EEM & DIOT: T_LD1-T_LD4 T_R1 T_R3 T_R5 T_R6 T_T1 T_TP1-T_TP8
Optional EEM & DIOT: T_LD5 T_R100 T_TP9

### Ports
FPGA_CFG (harness FPGA_CFG), GND, P3V3 (in), P3V3_MP (in), P12V0 (in), PGOOD (in), PSU_EN (in)

### Nets
GND: T_LD3.1(C) T_LD4.1(C) T_T1.2(S) T_TP5.1 T_TP6.1 T_TP7.1 ; port GND
P3V3: T_R5.2 T_R100.2 T_TP2.1 ; port P3V3
P3V3_MP: T_R1.2 T_R6.2 T_TP3.1 ; port P3V3_MP
P12V0: T_R3.1 T_TP1.1 ; port P12V0
FPGA_CFG.FPGA_CDONE: T_LD5.1(C) T_TP9.1
PGOOD: T_T1.1(G) T_TP4.1 ; port PGOOD
PSU_EN: T_LD1.1(C) T_TP8.1 ; port PSU_EN
NetT_LD1_2: T_LD1.2(A) T_R1.1
NetT_LD2_1: T_LD2.1(C) T_T1.3(D)
NetT_LD2_2: T_LD2.2(A) T_R3.2
NetT_LD3_2: T_LD3.2(A) T_R5.1
NetT_LD4_2: T_LD4.2(A) T_R6.1
NetT_LD5_2: T_LD5.2(A) T_R100.1

### Buses and harness runs
harness FPGA_CFG = port FPGA_CFG

### Notes on the sheet
- User Design
- HOW TO:
  1. Add LEDs to indicate the state of the power rails used on the card.
  2. Add test points for the power rails and several GND test points.
- HOW TO:
  1. Place PGOOD and PSU_EN diodes on the front panel.
- Release
- Last modified =ModifiedDate
  Sheet =sheetnumber of =sheettotal · Size A4
- Copyright =P_copyright_owner
  This source describes Open Hardware and is licensed under the CERN-OHL-W v2. You may redistribute and modify this source and make products using it under the terms of the CERN-OHL-W v2 (https://cern.ch/cern-ohl). This source is distributed WITHOUT ANY EXPRESS OR IMPLIED WARRANTY, INCLUDING OF MERCHANTABILITY, SATISFACTORY QUALITY AND FITNESS FOR A PARTICULAR PURPOSE. Please see the CERN-OHL-W v2 for applicable conditions.
  Notice: If You produce hardware based on this source, You must maintain the Source Location visible on the product, its packaging or its documentation.
- SINARA OPEN HARDWARE
- OPEN HARDWARE FOR SCIENTIFIC INSTRUMENTATION
- https://github.com/sinara-hw
- Release owner
- Designers
- Reviewers
- Source location:

### Library data of the parts
T_LD1 T_LD5 = LED_AVAGO_HSMC-C110: LED Red 1C 2A; Part Description: High Performance Right Angle Chip Red LED; Manufacturer: AVAGO TECHNOLOGIES; PressFit: No; Bonding: No; Part Number: LED_AVAGO_HSMC-C110; Component Kind: Standard; Component Type: Standard; Color: Red; PackageDescription: Red Chip LED, 2-Leads, Body 3.3x1.6mm, Side Emitting Package; Status: Not Recommended; Manufacturer Part Number: HSMC-C110; Pin Count: 2; Case: 1206; Mounted: Yes; Socket: No; SMD: Yes; Sense: No; ComponentHeight: 1.1mm; HelpURL: \\cern.ch\dfs\Applications\Altium\Datasheets\LED_AVAGO_HSMC-C110.pdf; ComponentLink1URL: \\cern.ch\dfs\Applications\Altium\Datasheets\LED_AVAGO_HSMC-C110_DESIGN-GUIDE.pdf; ComponentLink1Description: Design Guide; Author: CERN DEM JMW; CreateDate: 30.07.2009; LatestRevisionDate: 20.06.2012
T_LD2 = LED_AVAGO_HSME-C110: LED Green 1C 2A; Part Description: High Performance Right Angle Chip Green LED; Manufacturer: AVAGO TECHNOLOGIES; PressFit: No; Bonding: No; Part Number: LED_AVAGO_HSME-C110; Component Kind: Standard; Component Type: Standard; Color: Green; PackageDescription: Green Chip LED, 2-Leads, Body 3.3x1.6mm, Side Emitting Package; Status: Not Recommended; Manufacturer Part Number: HSME-C110; Pin Count: 2; Case: 1206; Mounted: Yes; Socket: No; SMD: Yes; Sense: No; ComponentHeight: 1.1mm; HelpURL: \\cern.ch\dfs\Applications\Altium\Datasheets\LED_AVAGO_HSME-C110.pdf; ComponentLink1URL: \\cern.ch\dfs\Applications\Altium\Datasheets\LED_AVAGO_HSME-C110_DESIGN-GUIDE.pdf; ComponentLink1Description: Design Guide; Author: CERN DEM JMW; CreateDate: 30.07.2009; LatestRevisionDate: 20.06.2012
T_LD3 T_LD4 = LED_KINGBRIGHT_KPH-1608CGCK: LED Green 1C 2A; Part Description: SMD Green LED, Case 1.6mmX0.8mm(0603), 0.65mm Thickness; PressFit: No; Bonding: No; Part Number: LED_KINGBRIGHT_KPH-1608CGCK; Component Kind: Standard; Component Type: Standard; Color: Green; PackageDescription: SMT Green LED, Case 0603, Body L 1.6 x W 0.8mm H 0.65mm; Manufacturer: KINGBRIGHT; Manufacturer Part Number: KPH-1608CGCK; Pin Count: 2; Mounted: Yes; Socket: No; SMD: Yes; Sense: No; ComponentHeight: 0.65mm; HelpURL: \\cern.ch\dfs\Applications\Altium\Datasheets\LED_KINGBRIGHT_KPH-1608CGCK.pdf; Author: CERN DEM JLC; CreateDate: 03.07.2017; LatestRevisionDate: 03.07.2017
T_R1 T_R5 T_R6 T_R100 = R0402_1K6_1%_0.0625W_100PPM: Resistor - 1%; Part Description: General Purpose Thick Film Chip Resistor; Manufacturer: GENERIC; Manufacturer1 Part Number: 232270671602L; TC: ±100ppm/°C; PressFit: No; Part Number: R0402_1K6_1%_0.0625W_100PPM; Component Kind: Standard; Component Type: Standard; Pin Count: 2; Value: 1k6; Status: Not Recommended; Power: 0.0625W; Tolerance: ±1%; Manufacturer Part Number: R0402_1K6_1%_0.0625W_100PPM; Case: 0402; Mounted: Yes; Sense: No; Socket: No; SMD: Yes; Manufacturer1 Example: YAGEO PHYCOMP; Manufacturer1 ComponentHeight: 0.4mm; HelpURL: \\cern.ch\dfs\Applications\Altium\Datasheets\R0402_Phycomp_RC0402.pdf; Author: CERN DEM JLC; CreateDate: 03.12.2007; LatestRevisionDate: 17.10.2012
T_R3 = R0402_10K_1%_0.0625W_100PPM: as T_R7 on sheet Power_Supplies; Part Number: R0402_10K_1%_0.0625W_100PPM; Component Kind: Standard; Component Type: Standard; Pin Count: 2; Value: 10k; Status: Not Recommended; Power: 0.0625W; Tolerance: ±1%; Manufacturer Part Number: R0402_10K_1%_0.0625W_100PPM; Case: 0402; Mounted: Yes; Sense: No; Socket: No; SMD: Yes; Manufacturer1 Example: YAGEO PHYCOMP; Manufacturer1 ComponentHeight: 0.4mm; HelpURL: \\cern.ch\dfs\Applications\Altium\Datasheets\R0402_Phycomp_RC0402.pdf; Author: CERN DEM JLC; CreateDate: 03.12.2007; LatestRevisionDate: 17.10.2012
T_T1 = BSS138LT1G: as T_T2 on sheet Power-up_delay; Part Number: BSS138LT1G; Component Kind: Standard; Component Type: Standard; Device: BSS138LT1G; PackageDescription: SOT23, 0.95mm Pitch; 3 Pin, 1.40mm W X 3.00mm L X 1.10mm H body, IPC Medium Density; Manufacturer Part Number: BSS138L; Pin Count: 3; Case: SOT23-3; Mounted: Yes; Socket: No; SMD: Yes; Sense: No; ComponentHeight: 1.11mm; HelpURL: \\cern.ch\dfs\Applications\Altium\Datasheets\BSS138LT1G.pdf; Author: CERN DEM JLC; CreateDate: 23.03.2009; LatestRevisionDate: 25.05.2022
T_TP1-T_TP9 = SMD_PAD_1.27X1.27MM: Part Description: 1.27mm x 1.27mm PCB Copper Area (SMD Test Point); Mounted: No; Part Number: SMD_PAD_1.27X1.27MM; Component Type: Standard (No BOM); Pin Count: 1; Family: Test Point; Socket: No; SMD: Yes; Sense: No; Status: None; ComponentHeight: 0mm; HelpURL: Undefined; Author: CERN DEM JLC; CreateDate: 12.01.2008; LatestRevisionDate: 12.01.2008; PackageDescription: 1.27mm x 1.27mm PCB Copper Area (SMD Test Point)

## Sheet CPCIS_Connectors_P1_P6.SchDoc: =DocumentName
size A3; SPICEModelCacheRMUUFYQV: <root> / <DocumentId>RMUUFYQV</DocumentId> / </root>; DocumentNumber: 1; Revision: 0; SheetNumber: 8; SheetTotal: 18
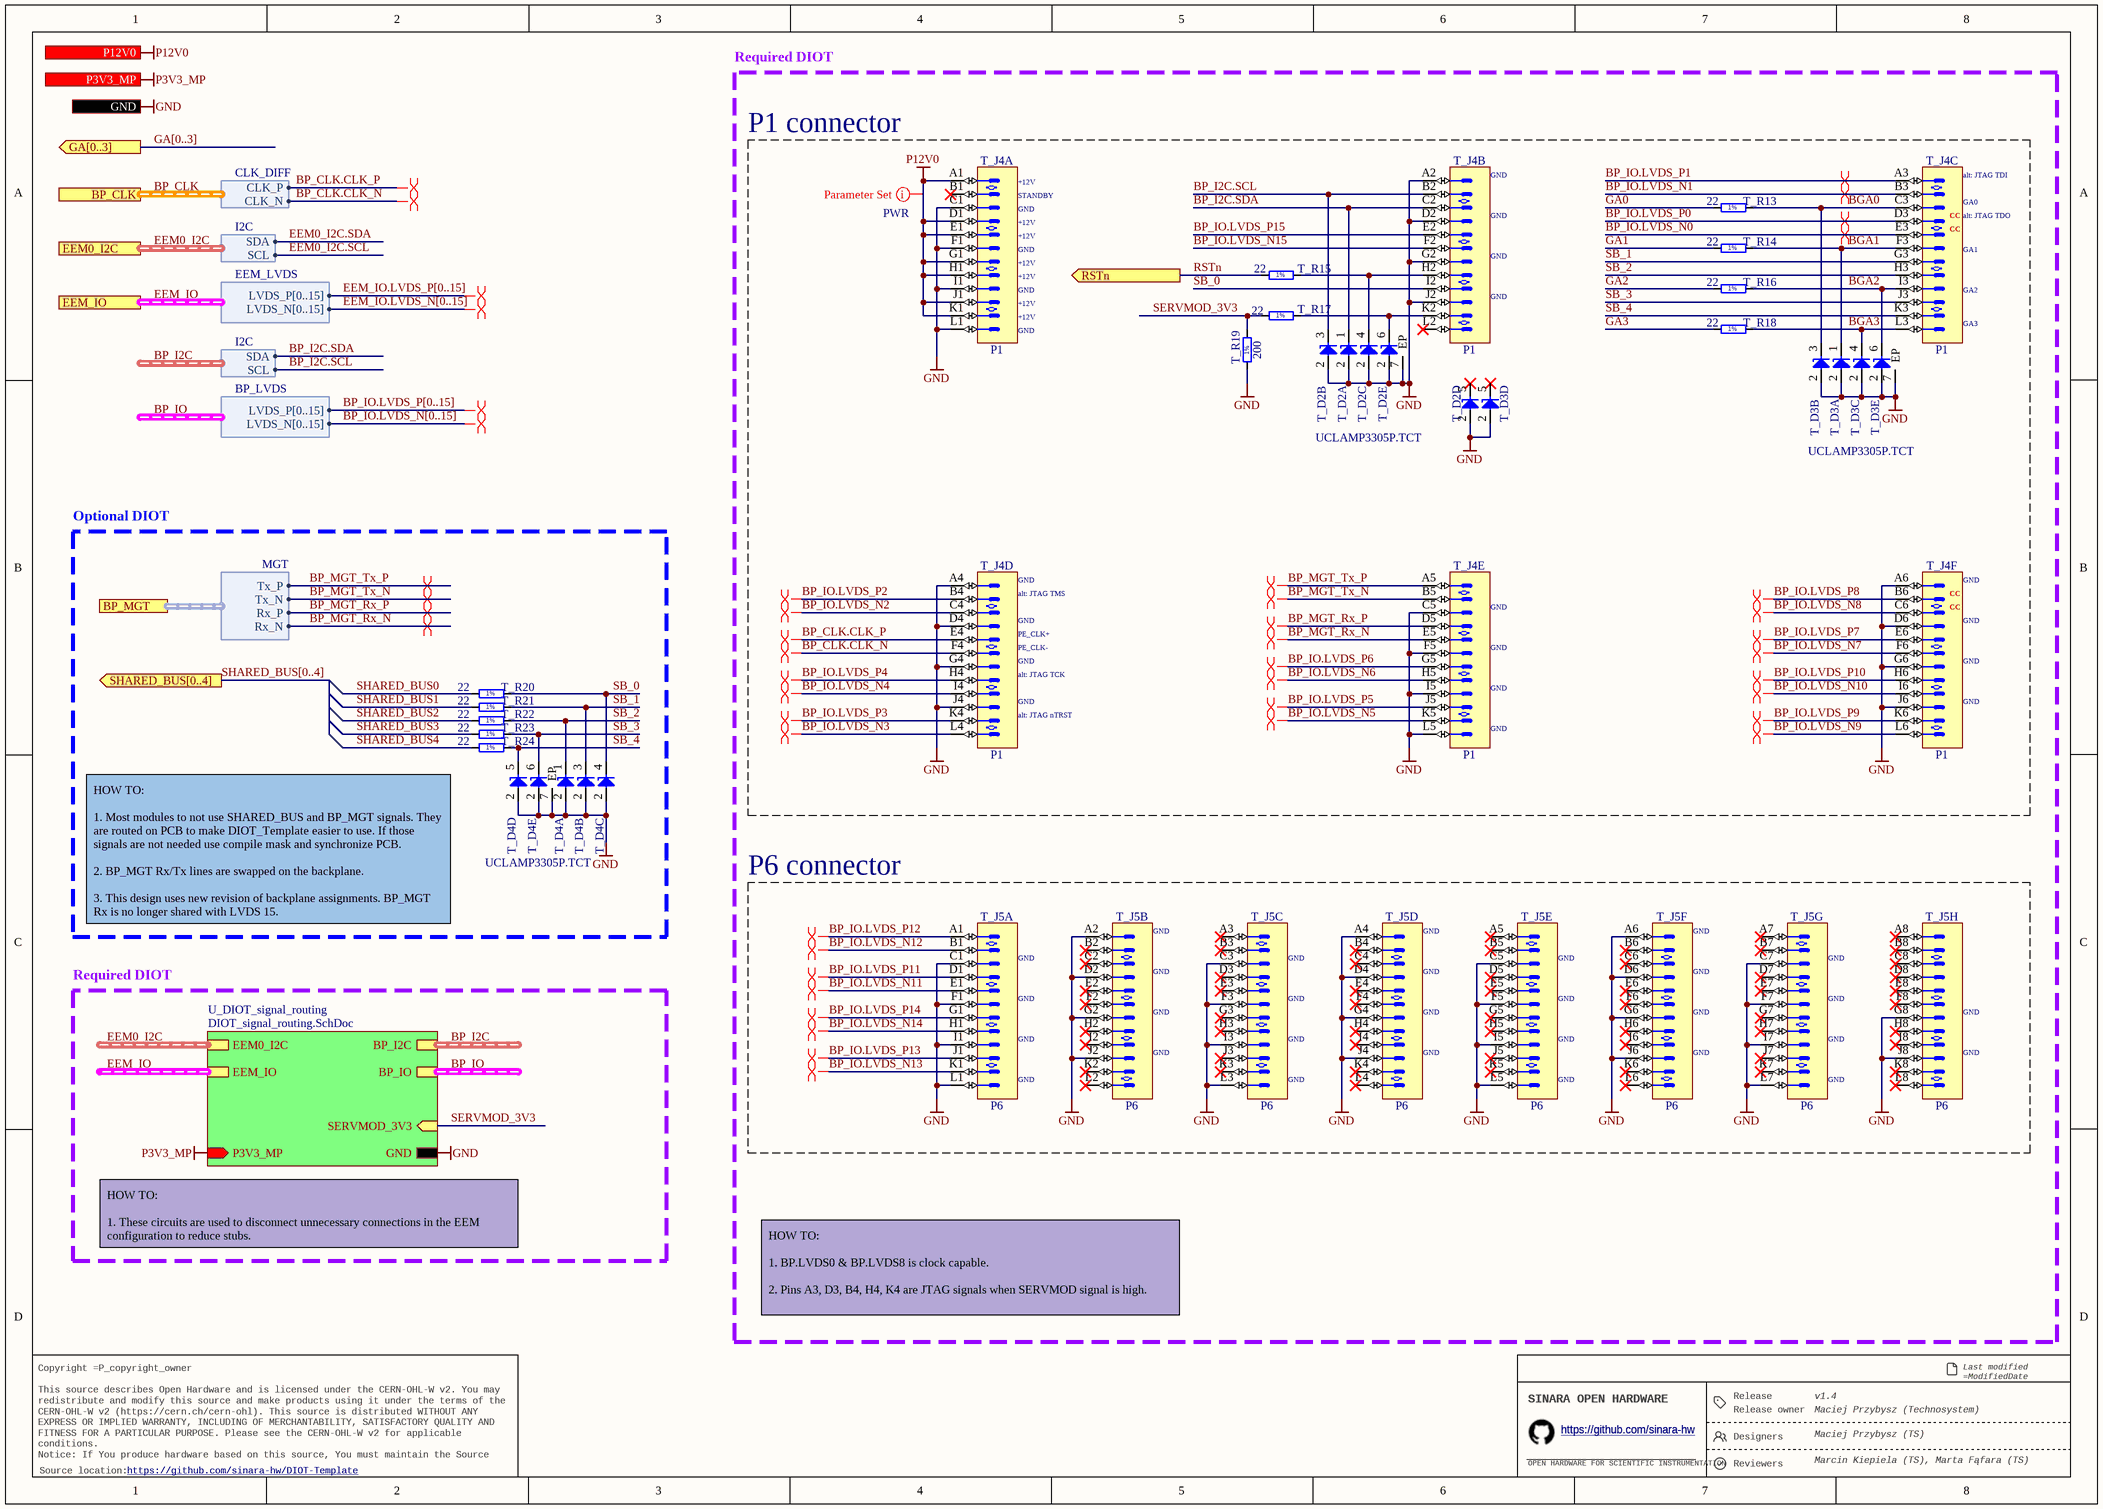
[diagram p5: CPCIS_Connectors_P1_P6.SchDoc]

### Parts
T_D2  UCLAMP3305P.TCT  [SON50P160X65_HS-7N]  (value not drawn)  (parts A,B,C,D,E of 5)
T_D3  UCLAMP3305P.TCT  [SON50P160X65_HS-7N]  (value not drawn)  (parts A,B,C,D,E of 5)
T_D4  UCLAMP3305P.TCT  [SON50P160X65_HS-7N]  (value not drawn)  (parts A,B,C,D,E of 5)
T_J4  P1  [AMPHENOL_10052825-101LF]  (parts A,B,C,D,E,F of 6)
T_J5  P6  [AMPHENOL_10052838-101LF]  (parts A,B,C,D,E,F,G,H of 8)
T_R13  22  [RESC1005X40N]
T_R14  22  [RESC1005X40N]
T_R15  22  [RESC1005X40N]
T_R16  22  [RESC1005X40N]
T_R17  22  [RESC1005X40N]
T_R18  22  [RESC1005X40N]
T_R19  200  [RESC1005X40N]
T_R20  22  [RESC1005X40N]
T_R21  22  [RESC1005X40N]
T_R22  22  [RESC1005X40N]
T_R23  22  [RESC1005X40N]
T_R24  22  [RESC1005X40N]

### Blocks framed on the sheet
P1 connector: T_D2 T_D3 T_J4 T_R13-T_R19
Optional DIOT: T_D4 T_R20-T_R24
P6 connector: T_J5

### Sub-sheets
U_DIOT_signal_routing = DIOT_signal_routing.SchDoc: BP_I2C (harness I2C), EEM0_I2C (harness I2C), EEM_IO (harness EEM_LVDS), BP_IO (harness BP_LVDS), SERVMOD_3V3 (in), GND, P3V3_MP (in)

### Ports
BP_CLK (harness CLK_DIFF), BP_MGT (harness MGT), EEM0_I2C (harness I2C), EEM_IO (harness EEM_LVDS), GA[0..3] (out), GND, P3V3_MP (in), P12V0 (out), RSTn (out), SHARED_BUS[0..4] (out)

### Harnesses
MGT: Tx_P, Tx_N, Rx_P, Rx_N
CLK_DIFF: CLK_N, CLK_P
I2C: SDA, SCL
EEM_LVDS: LVDS_P[0..15], LVDS_N[0..15]
BP_LVDS: LVDS_N[0..15], LVDS_P[0..15]

### Nets
GND: T_D2.2(A) T_D2.7(EP) T_D3.2(A) T_D3.7(EP) T_D4.2(A) T_D4.7(EP) T_J4.A2 T_J4.A4 T_J4.A6 T_J4.C1 T_J4.C5 T_J4.D2 T_J4.D4 T_J4.D6 T_J4.F1 T_J4.F5 T_J4.G2 T_J4.G4 T_J4.G6 T_J4.I1 T_J4.I5 T_J4.J2 T_J4.J4 T_J4.J6 T_J4.L1 T_J4.L5 T_J5.A2 T_J5.A4 T_J5.A6 T_J5.C1 T_J5.C3 T_J5.C5 T_J5.C7 T_J5.D2 T_J5.D4 T_J5.D6 T_J5.F1 T_J5.F3 T_J5.F5 T_J5.F7 T_J5.G2 T_J5.G4 T_J5.G6 T_J5.G8 T_J5.I1 T_J5.I3 T_J5.I5 T_J5.I7 T_J5.J2 T_J5.J4 T_J5.J6 T_J5.J8 T_J5.L1 T_J5.L3 T_J5.L5 T_J5.L7 T_R19.1 ; port GND, sheet U_DIOT_signal_routing/GND
P3V3_MP: port P3V3_MP, sheet U_DIOT_signal_routing/P3V3_MP
P12V0: T_J4.A1 T_J4.D1 T_J4.E1 T_J4.G1 T_J4.H1 T_J4.J1 T_J4.K1 ; port P12V0
BGA0: T_D3.3(C) T_J4.C3 T_R13.2
BGA1: T_D3.1(C) T_J4.F3 T_R14.2
BGA2: T_D3.6(C) T_J4.I3 T_R16.2
BGA3: T_D3.4(C) T_J4.L3 T_R18.2
BP_CLK.CLK_N: T_J4.F4 ; port BP_CLK.CLK_N
BP_CLK.CLK_P: T_J4.E4 ; port BP_CLK.CLK_P
BP_I2C.SCL: T_D2.3(C) T_J4.B2 ; sheet U_DIOT_signal_routing/BP_I2C.SCL
BP_I2C.SDA: T_D2.1(C) T_J4.C2 ; sheet U_DIOT_signal_routing/BP_I2C.SDA
BP_IO.LVDS_N0: T_J4.E3
BP_IO.LVDS_N1: T_J4.B3
BP_IO.LVDS_N2: T_J4.C4
BP_IO.LVDS_N3: T_J4.L4
BP_IO.LVDS_N4: T_J4.I4
BP_IO.LVDS_N5: T_J4.K5
BP_IO.LVDS_N6: T_J4.H5
BP_IO.LVDS_N7: T_J4.F6
BP_IO.LVDS_N8: T_J4.C6
BP_IO.LVDS_N9: T_J4.L6
BP_IO.LVDS_N10: T_J4.I6
BP_IO.LVDS_N11: T_J5.E1
BP_IO.LVDS_N12: T_J5.B1
BP_IO.LVDS_N13: T_J5.K1
BP_IO.LVDS_N14: T_J5.H1
BP_IO.LVDS_N15: T_J4.F2
BP_IO.LVDS_P0: T_J4.D3
BP_IO.LVDS_P1: T_J4.A3
BP_IO.LVDS_P2: T_J4.B4
BP_IO.LVDS_P3: T_J4.K4
BP_IO.LVDS_P4: T_J4.H4
BP_IO.LVDS_P5: T_J4.J5
BP_IO.LVDS_P6: T_J4.G5
BP_IO.LVDS_P7: T_J4.E6
BP_IO.LVDS_P8: T_J4.B6
BP_IO.LVDS_P9: T_J4.K6
BP_IO.LVDS_P10: T_J4.H6
BP_IO.LVDS_P11: T_J5.D1
BP_IO.LVDS_P12: T_J5.A1
BP_IO.LVDS_P13: T_J5.J1
BP_IO.LVDS_P14: T_J5.G1
BP_IO.LVDS_P15: T_J4.E2
BP_MGT_Rx_N: T_J4.E5 ; port BP_MGT.Rx_N  [project net BP_MGT.Rx_N]
BP_MGT_Rx_P: T_J4.D5 ; port BP_MGT.Rx_P  [project net BP_MGT.Rx_P]
BP_MGT_Tx_N: T_J4.B5 ; port BP_MGT.Tx_N  [project net BP_MGT.Tx_N]
BP_MGT_Tx_P: T_J4.A5 ; port BP_MGT.Tx_P  [project net BP_MGT.Tx_P]
GA0: T_R13.1
GA1: T_R14.1
GA2: T_R16.1
GA3: T_R18.1
RSTn: T_R15.1 ; port RSTn
SB_0: T_D4.4(C) T_J4.I2 T_R20.2
SB_1: T_D4.3(C) T_J4.G3 T_R21.2
SB_2: T_D4.1(C) T_J4.H3 T_R22.2
SB_3: T_D4.6(C) T_J4.J3 T_R23.2
SB_4: T_D4.5(C) T_J4.K3 T_R24.2
SERVMOD_3V3: T_R17.1 T_R19.2 ; sheet U_DIOT_signal_routing/SERVMOD_3V3
SHARED_BUS0: T_R20.1
SHARED_BUS1: T_R21.1
SHARED_BUS2: T_R22.1
SHARED_BUS3: T_R23.1
SHARED_BUS4: T_R24.1
NetT_D2_4: T_D2.4(C) T_J4.H2 T_R15.2
NetT_D2_6: T_D2.6(C) T_J4.K2 T_R17.2

Not connected (* = marked no-connect by the designer): T_D2 5(C)*; T_D3 5(C)*; T_J4 B1* L2*; T_J5 A3* A5* A7* A8* B2* B3* B4* B5* B6* B7* B8* C2* C4* C6* C8* D3* D5* D7* D8* E2* E3* E4* E5* E6* E7* E8* F2* F4* F6* F8* G3* G5* G7* H2* H3* H4* H5* H6* H7* H8* I2* I4* I6* I8* J3* J5* J7* K2* K3* K4* K5* K6* K7* K8* L2* L4* L6* L8*

### Buses and harness runs
bus BP_IO.LVDS_N[0..15]
bus BP_IO.LVDS_P[0..15]
bus EEM_IO.LVDS_N[0..15]
bus EEM_IO.LVDS_P[0..15]
bus GA[0..3] = port GA[0..3]
bus SHARED_BUS[0..4] = port SHARED_BUS[0..4]
harness BP_CLK = port BP_CLK
harness BP_I2C = sheet U_DIOT_signal_routing/BP_I2C
harness BP_IO = sheet U_DIOT_signal_routing/BP_IO
harness EEM0_I2C = port EEM0_I2C
harness EEM0_I2C = sheet U_DIOT_signal_routing/EEM0_I2C
harness EEM_IO = port EEM_IO
harness EEM_IO = sheet U_DIOT_signal_routing/EEM_IO

### Layout directives
differential pair: (no net found under the mark), BP_IO.LVDS_N0, BP_IO.LVDS_N1, BP_IO.LVDS_N2, BP_IO.LVDS_N3, BP_IO.LVDS_N4, BP_IO.LVDS_N5, BP_IO.LVDS_N6, BP_IO.LVDS_N7, BP_IO.LVDS_N8, BP_IO.LVDS_N9, BP_IO.LVDS_N10, BP_IO.LVDS_N11, BP_IO.LVDS_N12, BP_IO.LVDS_N13, BP_IO.LVDS_N14, BP_IO.LVDS_P0, BP_IO.LVDS_P1, BP_IO.LVDS_P2, BP_IO.LVDS_P3, BP_IO.LVDS_P4, BP_IO.LVDS_P5, BP_IO.LVDS_P6, BP_IO.LVDS_P7, BP_IO.LVDS_P8, BP_IO.LVDS_P9, BP_IO.LVDS_P10, BP_IO.LVDS_P11, BP_IO.LVDS_P12, BP_IO.LVDS_P13, BP_IO.LVDS_P14
differential pair; differential pair class Diff_100Ohm: (no net found under the mark), BP_CLK.CLK_N, BP_CLK.CLK_P
differential pair; differential pair class MGT: BP_MGT.Rx_N, BP_MGT.Rx_P, BP_MGT.Tx_N, BP_MGT.Tx_P
net class PWR: P12V0

### Notes on the sheet
- Required DIOT
- (near T_J4) +12V
- (near T_J4) GND
- (near T_J4) alt: JTAG TDI
- (near T_J4) STANDBY
- (near T_J4) CC
- (near T_J4) alt: JTAG TDO
- (near T_J4) GA0
- (near T_J4) GA2
- (near T_J4) GA1
- (near T_J4) GA3
- (near T_J4) alt: JTAG TMS
- (near T_J4) PE_CLK+
- (near T_J4) PE_CLK-
- (near T_J4) alt: JTAG TCK
- (near T_J4) alt: JTAG nTRST
- HOW TO:
  1. Most modules to not use SHARED_BUS and BP_MGT signals. They are routed on PCB to make DIOT_Template easier to use. If those signals are not needed use compile mask and synchronize PCB.
  2. BP_MGT Rx/Tx lines are swapped on the backplane.
  3. This design uses new revision of backplane assignments. BP_MGT Rx is no longer shared with LVDS 15.
- (near T_J5) GND
- HOW TO:
  1. These circuits are used to disconnect unnecessary connections in the EEM configuration to reduce stubs.
- HOW TO:
  1. BP.LVDS0 & BP.LVDS8 is clock capable.
  2. Pins A3, D3, B4, H4, K4 are JTAG signals when SERVMOD signal is high.
- Release
- Last modified =ModifiedDate
  Sheet =sheetnumber of =sheettotal · Size A3
- Copyright =P_copyright_owner
  This source describes Open Hardware and is licensed under the CERN-OHL-W v2. You may redistribute and modify this source and make products using it under the terms of the CERN-OHL-W v2 (https://cern.ch/cern-ohl). This source is distributed WITHOUT ANY EXPRESS OR IMPLIED WARRANTY, INCLUDING OF MERCHANTABILITY, SATISFACTORY QUALITY AND FITNESS FOR A PARTICULAR PURPOSE. Please see the CERN-OHL-W v2 for applicable conditions.
  Notice: If You produce hardware based on this source, You must maintain the Source Location visible on the product, its packaging or its documentation.
- SINARA OPEN HARDWARE
- OPEN HARDWARE FOR SCIENTIFIC INSTRUMENTATION
- https://github.com/sinara-hw
- Release owner
- Designers
- Reviewers
- Source location:
- (in symbol R0402_22R_1%_0.0625W_100PPM) 1%
- (in symbol R0402_200R_1%_0.0625W_100PPM) 1%

### Library data of the parts
T_D2-T_D4 = CMP-004-00037-2: Diode TVS Quint Common Anode Uni-Dir 3.3V 40W 6-Pin SLP EP T/R; Max Operating Temperature: 125°C; Min Operating Temperature: -55°C; Pins: 6; Mounting Technology: Surface Mount
T_J4 = AMPHENOL_10052825-101LF: 72 Contacts Header, 6 Columns, 4 Pairs per Column; Part Description: 72 Contacts, 2mm Pitch, 6 Columns, 4 Pairs per Column, 4 Walls, Right Angle Header; Part Number: AMPHENOL_10052825-101LF; Component Kind: Standard; Component Type: Standard; Pin Count: 72; Family: AirMax VS; Mounted: Yes; Socket: No; SMD: No; PressFit: Yes; Sense: No; Status: None; Manufacturer: AMPHENOL; Manufacturer Part Number: 10052825-101LF; ComponentHeight: 15.35mm; HelpURL: \\cern.ch\dfs\Applications\Altium\Datasheets\AMPHENOL_10052825-101LF.pdf; ComponentLink1URL: \\cern.ch\dfs\Applications\Altium\Datasheets\AMPHENOL_10052825-101LF_Application.pdf; ComponentLink1Description: Application; Author: CERN DEM MR; CreateDate: 19/02/2018; LatestRevisionDate: 19/02/2018; Classname: Overlapping
T_J5 = AMPHENOL_10052838-101LF: 96 Contacts Header, 8 Columns, 4 Pairs per Column; Part Description: 96 Contacts, 2mm Pitch, 8 Columns, 4 Pairs per Column, 4 Walls, Right Angle Header; Part Number: AMPHENOL_10052838-101LF; Component Kind: Standard; Component Type: Standard; Pin Count: 96; Family: AirMax VS; Mounted: Yes; Socket: No; SMD: No; PressFit: Yes; Sense: No; Status: None; Manufacturer: AMPHENOL; Manufacturer Part Number: 10052838-101LF; ComponentHeight: 15.35mm; HelpURL: \\cern.ch\dfs\Applications\Altium\Datasheets\AMPHENOL_10052838-101LF.pdf; ComponentLink1URL: \\cern.ch\dfs\Applications\Altium\Datasheets\AMPHENOL_10052838-101LF_Application.pdf; ComponentLink1Description: Application; Author: CERN DEM MR; CreateDate: 19.02.2018; LatestRevisionDate: 19.02.2018
T_R13-T_R18 T_R20-T_R24 = R0402_22R_1%_0.0625W_100PPM: Resistor - 1%; Part Description: General Purpose Thick Film Chip Resistor; Manufacturer: GENERIC; Manufacturer1 Part Number: 232270672209L; PressFit: No; Part Number: R0402_22R_1%_0.0625W_100PPM; Component Kind: Standard; Component Type: Standard; Pin Count: 2; Value: 22; Status: Not Recommended; Power: 0.0625W; Tolerance: ±1%; Manufacturer Part Number: R0402_22R_1%_0.0625W_100PPM; Case: 0402; Mounted: Yes; Socket: No; SMD: Yes; Manufacturer1 Example: YAGEO PHYCOMP; Manufacturer1 ComponentHeight: 0.4mm; HelpURL: \\cern.ch\dfs\Applications\Altium\Datasheets\R0402_Phycomp_RC0402.pdf; Author: CERN DEM JLC; CreateDate: 03.12.2007; LatestRevisionDate: 17.10.2012; Sense: No
T_R19 = R0402_200R_1%_0.0625W_100PPM: Resistor - 1%; Part Description: General Purpose Thick Film Chip Resistor; Manufacturer: GENERIC; Manufacturer1 Part Number: 232270672001L; TC: ±100ppm/°C; PressFit: No; Part Number: R0402_200R_1%_0.0625W_100PPM; Component Kind: Standard; Component Type: Standard; Pin Count: 2; Value: 200; Status: Not Recommended; Power: 0.0625W; Tolerance: ±1%; Manufacturer Part Number: R0402_200R_1%_0.0625W_100PPM; Case: 0402; Mounted: Yes; Sense: No; Socket: No; SMD: Yes; Manufacturer1 Example: YAGEO PHYCOMP; Manufacturer1 ComponentHeight: 0.4mm; HelpURL: \\cern.ch\dfs\Applications\Altium\Datasheets\R0402_Phycomp_RC0402.pdf; Author: CERN DEM JLC; CreateDate: 2007-12-03; LatestRevisionDate: 2012-10-17